# Altium schematic sheet main.SchDoc
size A4; SheetNumber: 1; SheetTotal: 12
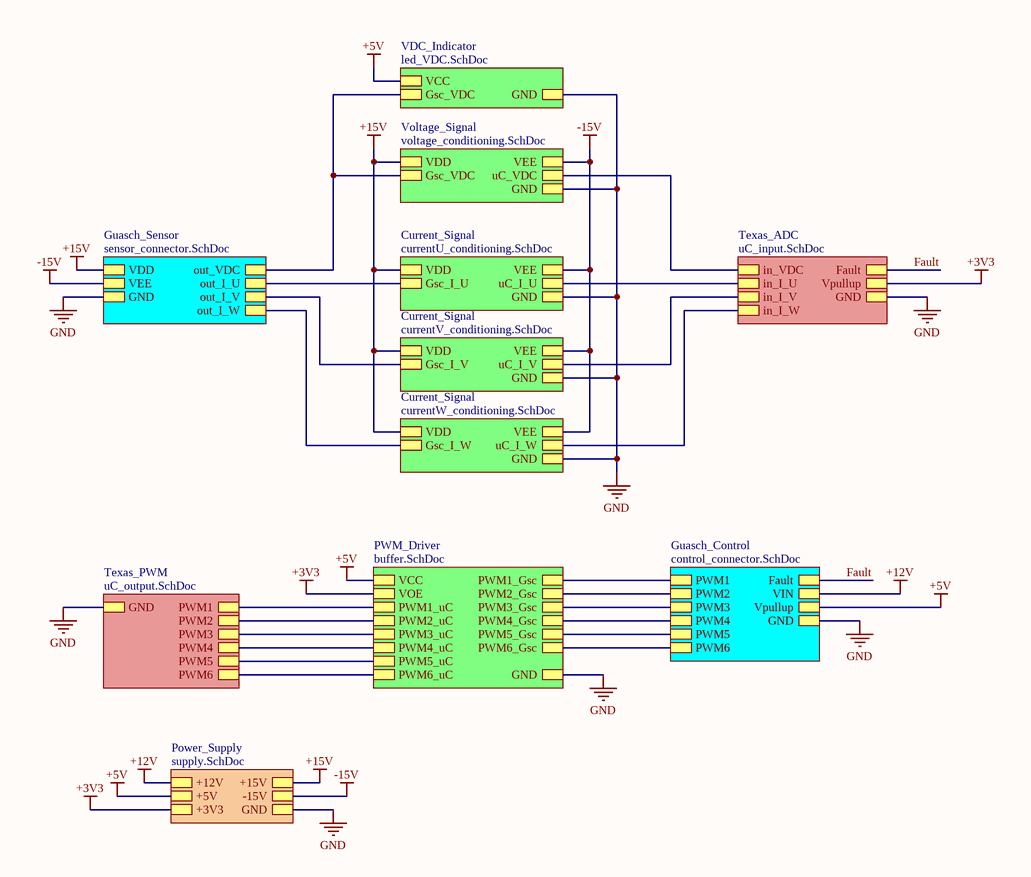
[diagram p0: main.SchDoc]

## Sub-sheets
Current_Signal = currentU_conditioning.SchDoc: Gsc_I_U, uC_I_U, VDD, VEE, GND
Current_Signal = currentV_conditioning.SchDoc: Gsc_I_V, uC_I_V, VDD, VEE, GND
Current_Signal = currentW_conditioning.SchDoc: Gsc_I_W, uC_I_W, VDD, VEE, GND
Guasch_Control = control_connector.SchDoc: PWM1, PWM2, PWM3, Fault, PWM4, PWM5, PWM6, VIN, GND, Vpullup
Guasch_Sensor = sensor_connector.SchDoc: out_I_U, out_I_V, out_I_W, VDD, VEE, GND, out_VDC
Power_Supply = supply.SchDoc: +15V, -15V, +12V, +5V, +3V3, GND
PWM_Driver = buffer.SchDoc: PWM1_uC, PWM2_uC, PWM3_uC, PWM4_uC, PWM5_uC, PWM6_uC, PWM1_Gsc, PWM2_Gsc, PWM3_Gsc, PWM4_Gsc, PWM5_Gsc, PWM6_Gsc, VCC, GND, VOE
Texas_ADC = uC_input.SchDoc: in_VDC, in_I_U, in_I_V, in_I_W, Fault, Vpullup, GND
Texas_PWM = uC_output.SchDoc: PWM1, PWM2, PWM3, PWM4, PWM5, PWM6, GND
VDC_Indicator = led_VDC.SchDoc: VCC, Gsc_VDC, GND
Voltage_Signal = voltage_conditioning.SchDoc: Gsc_VDC, uC_VDC, VDD, VEE, GND

## Nets
+3V3: sheet PWM_Driver/VOE, sheet Texas_ADC/Vpullup, sheet Power_Supply/+3V3
+5V: sheet PWM_Driver/VCC, sheet Guasch_Control/Vpullup, sheet Power_Supply/+5V, sheet VDC_Indicator/VCC
+12V: sheet Guasch_Control/VIN, sheet Power_Supply/+12V
+15V: sheet Guasch_Sensor/VDD, sheet Current_Signal/VDD, sheet Voltage_Signal/VDD, sheet Current_Signal/VDD, sheet Current_Signal/VDD, sheet Power_Supply/+15V
-15V: sheet Guasch_Sensor/VEE, sheet Current_Signal/VEE, sheet Voltage_Signal/VEE, sheet Current_Signal/VEE, sheet Current_Signal/VEE, sheet Power_Supply/-15V
GND: sheet PWM_Driver/GND, sheet Guasch_Control/GND, sheet Guasch_Sensor/GND, sheet Current_Signal/GND, sheet Voltage_Signal/GND, sheet Texas_ADC/GND, sheet Texas_PWM/GND, sheet Current_Signal/GND, sheet Current_Signal/GND, sheet Power_Supply/GND, sheet VDC_Indicator/GND
Fault: sheet Guasch_Control/Fault, sheet Texas_ADC/Fault
(unnamed): sheet PWM_Driver/PWM1_uC, sheet Texas_PWM/PWM1
(unnamed): sheet PWM_Driver/PWM2_uC, sheet Texas_PWM/PWM2
(unnamed): sheet PWM_Driver/PWM3_uC, sheet Texas_PWM/PWM3
(unnamed): sheet PWM_Driver/PWM4_uC, sheet Texas_PWM/PWM4
(unnamed): sheet PWM_Driver/PWM5_uC, sheet Texas_PWM/PWM5
(unnamed): sheet PWM_Driver/PWM6_uC, sheet Texas_PWM/PWM6
(unnamed): sheet PWM_Driver/PWM1_Gsc, sheet Guasch_Control/PWM1
(unnamed): sheet PWM_Driver/PWM2_Gsc, sheet Guasch_Control/PWM2
(unnamed): sheet PWM_Driver/PWM3_Gsc, sheet Guasch_Control/PWM3
(unnamed): sheet PWM_Driver/PWM4_Gsc, sheet Guasch_Control/PWM4
(unnamed): sheet PWM_Driver/PWM5_Gsc, sheet Guasch_Control/PWM5
(unnamed): sheet PWM_Driver/PWM6_Gsc, sheet Guasch_Control/PWM6
(unnamed): sheet Guasch_Sensor/out_I_U, sheet Current_Signal/Gsc_I_U
(unnamed): sheet Guasch_Sensor/out_I_V, sheet Current_Signal/Gsc_I_V
(unnamed): sheet Guasch_Sensor/out_I_W, sheet Current_Signal/Gsc_I_W
(unnamed): sheet Guasch_Sensor/out_VDC, sheet Voltage_Signal/Gsc_VDC, sheet VDC_Indicator/Gsc_VDC
(unnamed): sheet Current_Signal/uC_I_U, sheet Texas_ADC/in_I_U
(unnamed): sheet Voltage_Signal/uC_VDC, sheet Texas_ADC/in_VDC
(unnamed): sheet Texas_ADC/in_I_V, sheet Current_Signal/uC_I_V
(unnamed): sheet Texas_ADC/in_I_W, sheet Current_Signal/uC_I_W